# EAGLE design RGB_Blinker (EAGLE 9.3.0)
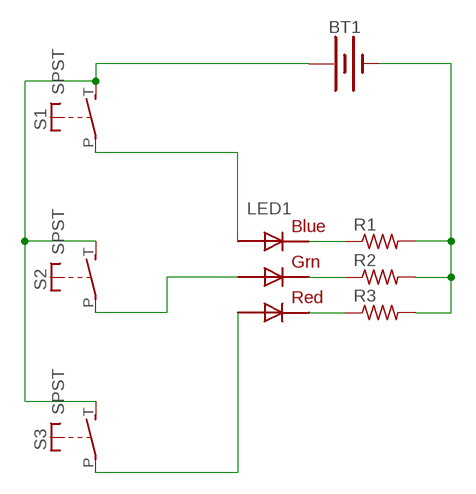
[diagram p0: schematic, sheet 1]

## Parts
BT1  BATTERY-20MM_SMD  [BATTCON_20MM]
LED1  RGBLED5050  [RGBLED5050]
R1  R-US_M2012  [M2012]
R2  R-US_M2012  [M2012]
R3  R-US_M2012  [M2012]
S1  SPST  [JUDCOSPST]
S2  SPST  [JUDCOSPST]
S3  SPST  [JUDCOSPST]

## Nets
N$1: BT1.1(+) S1.T(S) S2.T(S) S3.T(S)
N$2: LED1.6(GREEN_C) R2.1
N$3: LED1.4(BLUE_C) R1.1
N$4: LED1.5(RED_C) R3.1
N$5: BT1.2(-) R1.2 R2.2 R3.2
N$6: LED1.3(BLUE_A) S1.P
N$7: LED1.2(RED_A) S3.P
N$8: LED1.1(GREEN_A) S2.P

## Library data of the parts
BT1 = SparkFun-Batteries:BATTERY: Battery - Single Cell A variety of battery chemistries, sizes, and footprints. Device List: 20MM_PTH - Coin Cell Battery Holder - 20mm (PTH) <https://www.sparkfun.com/products/783> 6.8MM_PTH - Coin Cell Battery Holder - 6.8MM(SMD) <https://www.digikey.com/product-detail/en/seiko-instruments/MS621FE-FL11E/728-1057-ND/1889208?WT.srch=1&gclid=CNOQ5a6LzdQCFZS2wAodXCkE0g> 12MM_SMD - Coin Cell Battery Holder - 12mm (SMD) <https://www.sparkfun.com/products/10592> 12MM_PTH - Coin Cell Battery Holder - 12mm (PTH) <https://www.sparkfun.com/products/7948> 20MM_SMD - 20mm Coin Cell Battery Holder (SMD) (2 legs) Used on the Big Time Watch Kit <https://www.sparkfun.com/products/11734> 20MM_SMD_4LEGS - Coin Cell Battery Holder - 20mm (SMD) <https://www.sparkfun.com/products/11892> 20MM_SMD_4LEGS_OVERPASTE - Coin Cell Battery Holder - 20mm (SMD) <https://www.sparkfun.com/products/11892> (Over-paste on the legs) 24.5MM_PTH - Coin Cell Battery Holder - 24.5mm (PTH) <https://www.sparkfun.com/products/8863> 9V - 9V Battery Holder - PC Mount Used on the SparkFun SparkPunk Sound Kit <https://www.sparkfun.com/products/11177> and SparkFun SparkPunk Sequencer Kit <https://www.sparkfun.com/products/12707> 18650 - Battery Holder - 18650 (PTH) <https://www.sparkfun.com/products/13113> AA - Battery Holder - 1xAA (PTH) <https://www.sparkfun.com/products/7949> AAA - Battery Holder - 1xAAA (PTH) <https://www.sparkfun.com/products/12718> AA_KIT - Battery Holder - 1xAA (PTH) <https://www.sparkfun.com/products/7949> Special kit package - pads only have exposed copper on one side of the board. AAA_KIT - Battery Holder - 1xAAA (PTH) <https://www.sparkfun.com/products/12718> Special kit package - pads only have exposed copper on one side of the board.; PROD_ID: BATT-11519
LED1 = adafruit:RGBLED: For 5050 RGB LEDs, the order of the LEDs may vary from one manufacturer to another!
R1-R3 = adafruit:R-US_: RESISTOR, American symbol
S1-S3 = adafruit:SPST: Judco 50-0015-00

## Board
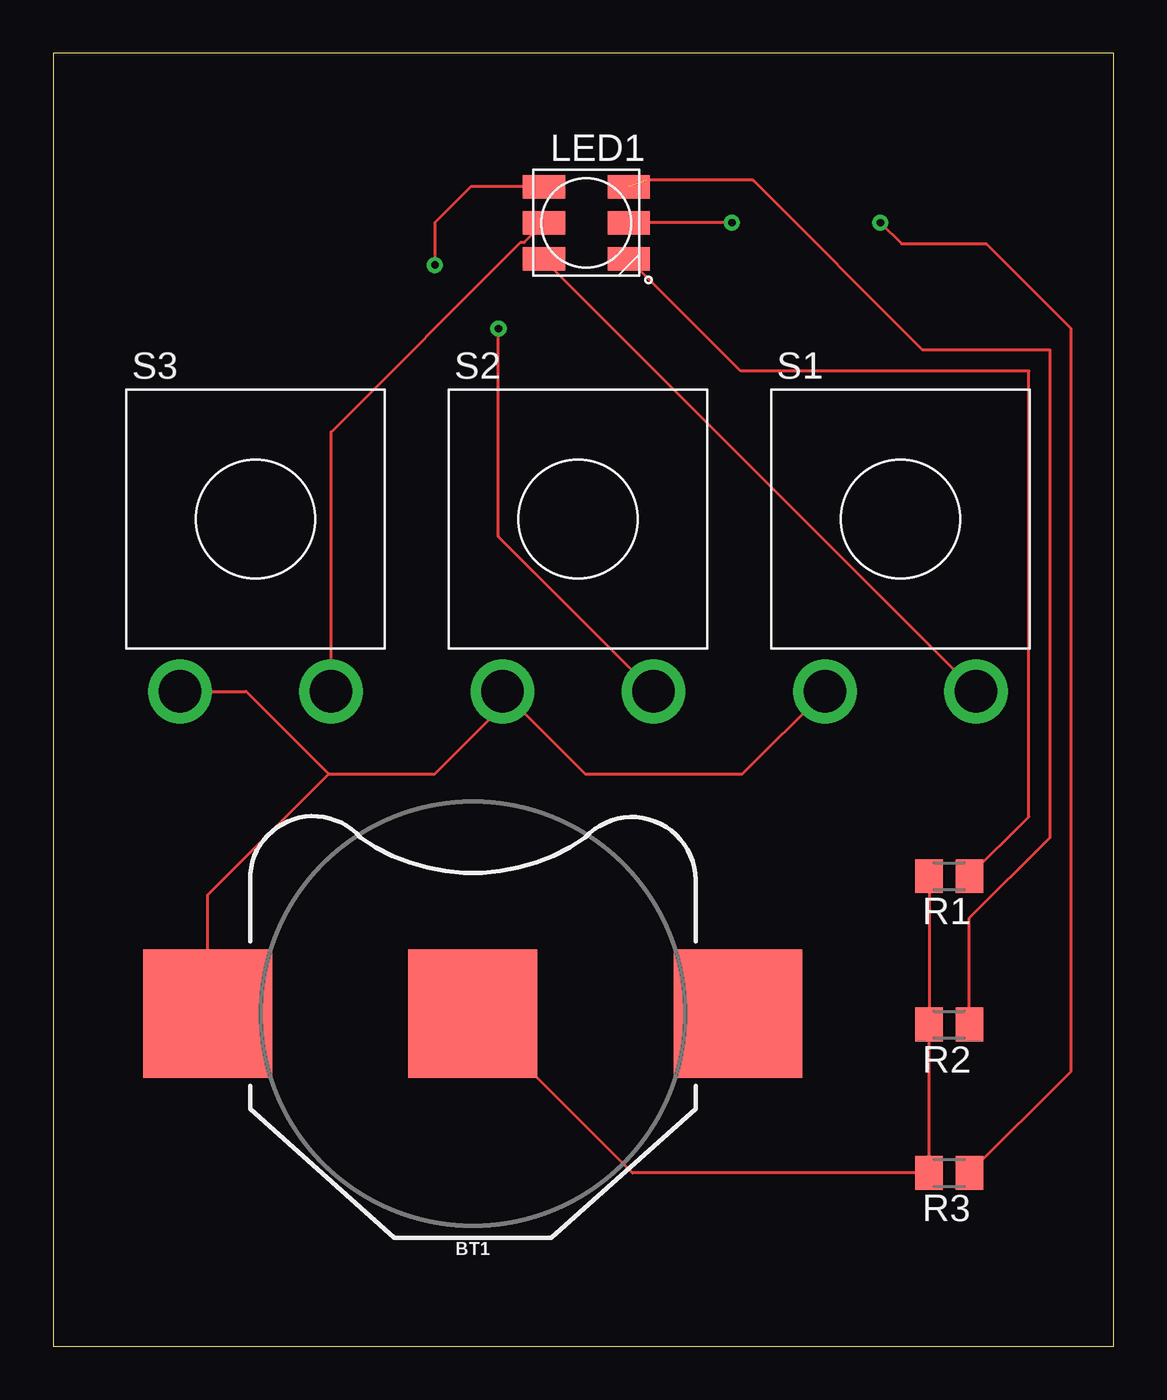
[diagram p1: board, top side]
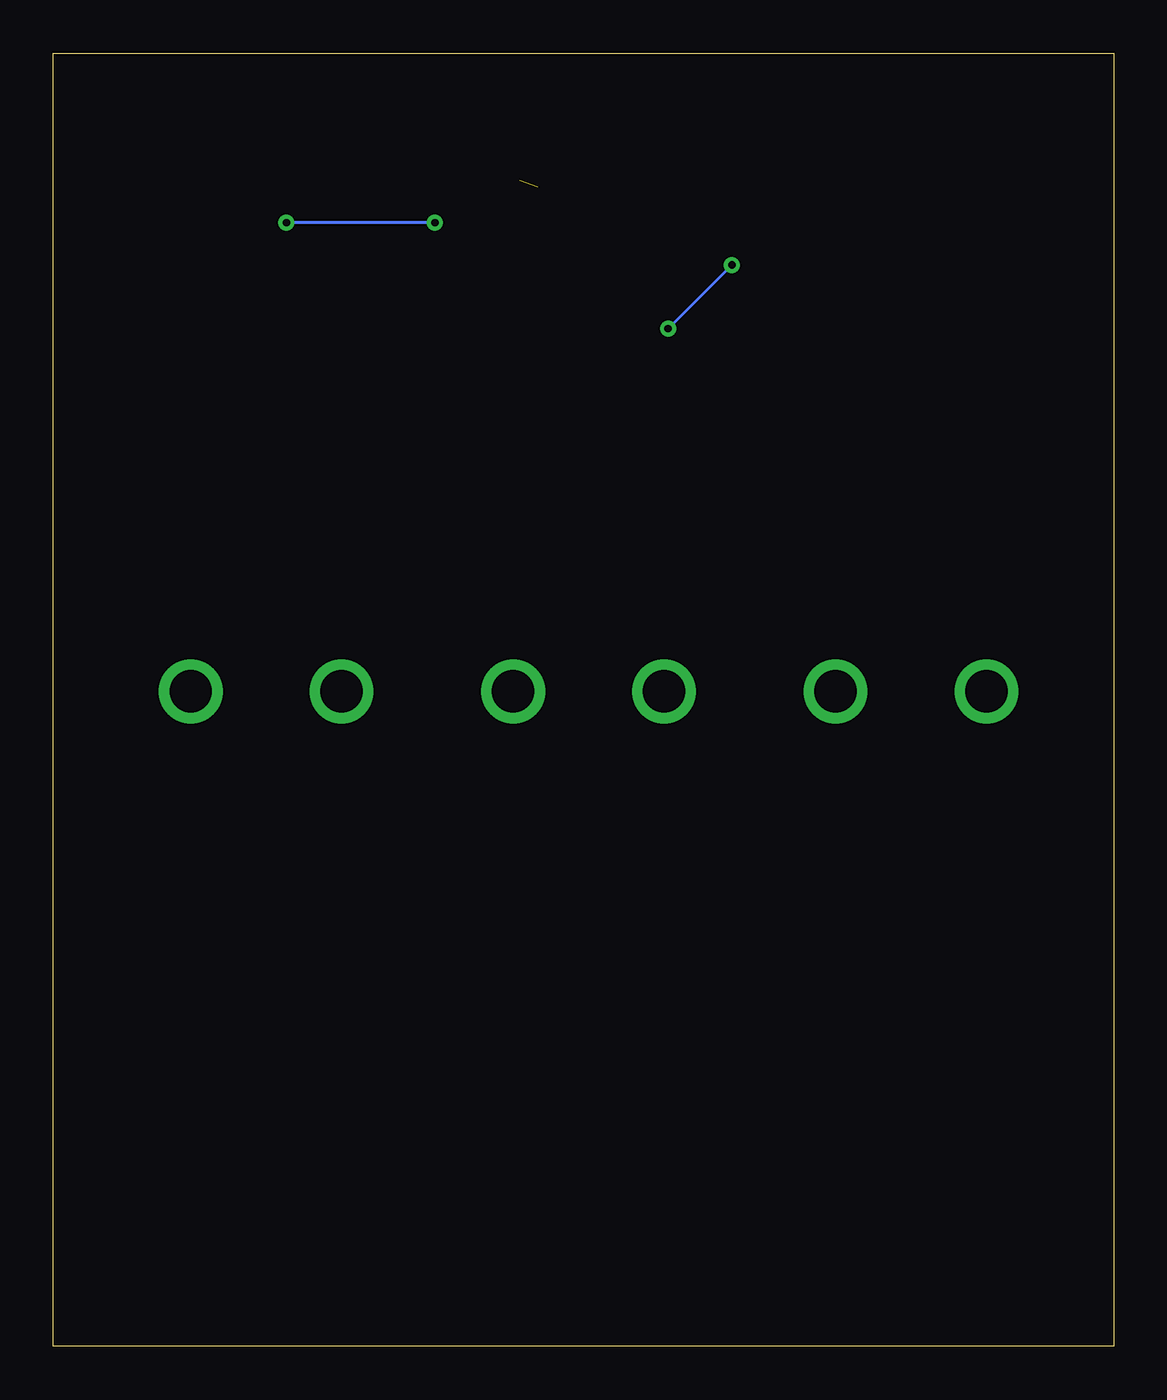
[diagram p2: board, bottom side, seen from below]

Size 50 x 61 mm. Coordinates in mm from the lower left corner, seen from the top.
Outline: 0,0 50,0 50,61 0,61 0,0
Copper layers (1*16): Top 0.035mm / dielectric 1.5mm / Bottom 0.035mm
Design rules "default": minimum track width 6mil, minimum drill 0.35mm, track to track 6mil, track to pad 6mil, pad to pad 6mil, via to via 6mil, smd to smd 6mil, copper to edge 40mil, drill to drill 6mil, minimum pad ring 10mil, minimum via ring 8mil, stop-mask expansion 4mil, vias tented up to drill 0mil, thermal gap 10mil

### Footprints (pad centres in the part's own frame; a part is rotated, then mirrored left to right if it is on the bottom)
BATTCON_20MM = smd 6.07 x 6.07: 1 -12.5,0; 2 0,0; 3 12.5,0
RGBLED5050 = smd 2 x 1.1: 1 -2,1.7; 2 -2,0; 3 -2,-1.7; 4 2,-1.7; 5 2,0; 6 2,1.7
M2012 = smd 1.3 x 1.6: 1 -0.95,0; 2 0.95,0
JUDCOSPST = drill 2: P 3.556,-8.128; T -3.556,-8.128

### Placement (x,y rotation side)
BT1  19.79,15.7 0 top
LED1  25.14,52.99 0 top
R1  42.25,22.18 180 top
R2  42.25,15.18 180 top
R3  42.25,8.18 180 top
S1  39.95,39.02 0 top
S2  24.75,39.02 0 top
S3  9.55,39.02 0 top

### Tracks (layer width: path | path; a pad name or v marks a point on that pad's centre or on a via)
N$1
  Top 0.152: S3.T 9.11,30.89 13,27 | 13,27 18,27 21.19,30.19 S2.T 25.09,27 32.5,27 S1.T | BT1.1 7.29,21.29 13,27
N$2  (1 unrouted)
  Top 0.152: R2.1 43.2,20.2 47,24 47,47 41,47 33,55 28,55
N$3
  Top 0.152: R1.1 46,24.98 46,46 32.43,46 LED1.4
N$4  (via drill 0.35)
  Top 0.152: R3.1 48,12.98 48,48 44,52 40,52 v39,53 | v32,53 v31.99,52.99 LED1.5
  Bottom 0.152: v32,53 v39,53
N$5
  Top 0.152: R1.2 R2.2 R3.2 27.31,8.18 BT1.2
N$6
  Top 0.152: S1.P 23.14,51.26 LED1.3
N$7
  Top 0.152: LED1.2 22.22,52.07 22.05,52.07 13.11,43.13 S3.P
N$8  (via drill 0.35)
  Top 0.152: S2.P 21,38.2 v21,48 | LED1.1 19.69,54.69 18,53 v18,51
  Bottom 0.152: v18,51 v21,48